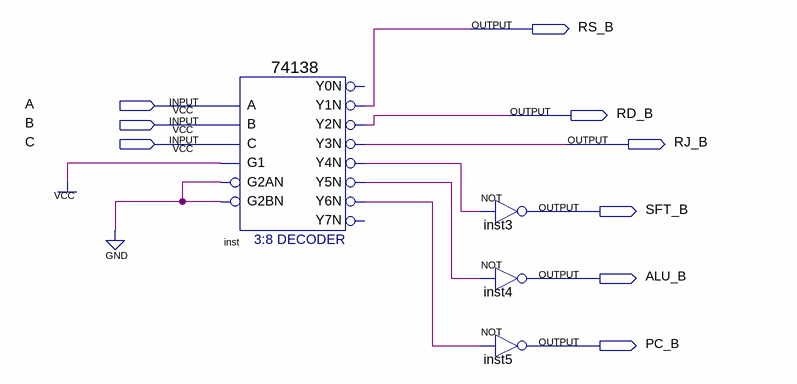
[diagram p0: schematic sheet]
// Quartus schematic decoder_B.bdf as structural Verilog: 4 symbols, 9 pins
module decoder_B (
  input  A,
  input  B,
  input  C,
  output RS_B,
  output RD_B,
  output RJ_B,
  output SFT_B,
  output ALU_B,
  output PC_B
);

  wire inst_y4n, inst_y5n, inst_y6n;

  \74138  inst (
    .A(A), .B(B), .G1(1'b1), .C(C), .G2AN(1'b0), .G2BN(1'b0), .Y1N(RS_B), .Y2N(RD_B), .Y3N(RJ_B),
    .Y4N(inst_y4n), .Y5N(inst_y5n), .Y6N(inst_y6n));  // open: Y0N, Y7N
  not inst3 (SFT_B, inst_y4n);
  not inst4 (ALU_B, inst_y5n);
  not inst5 (PC_B, inst_y6n);
endmodule
